# EAGLE design main (EAGLE 6.5.0)
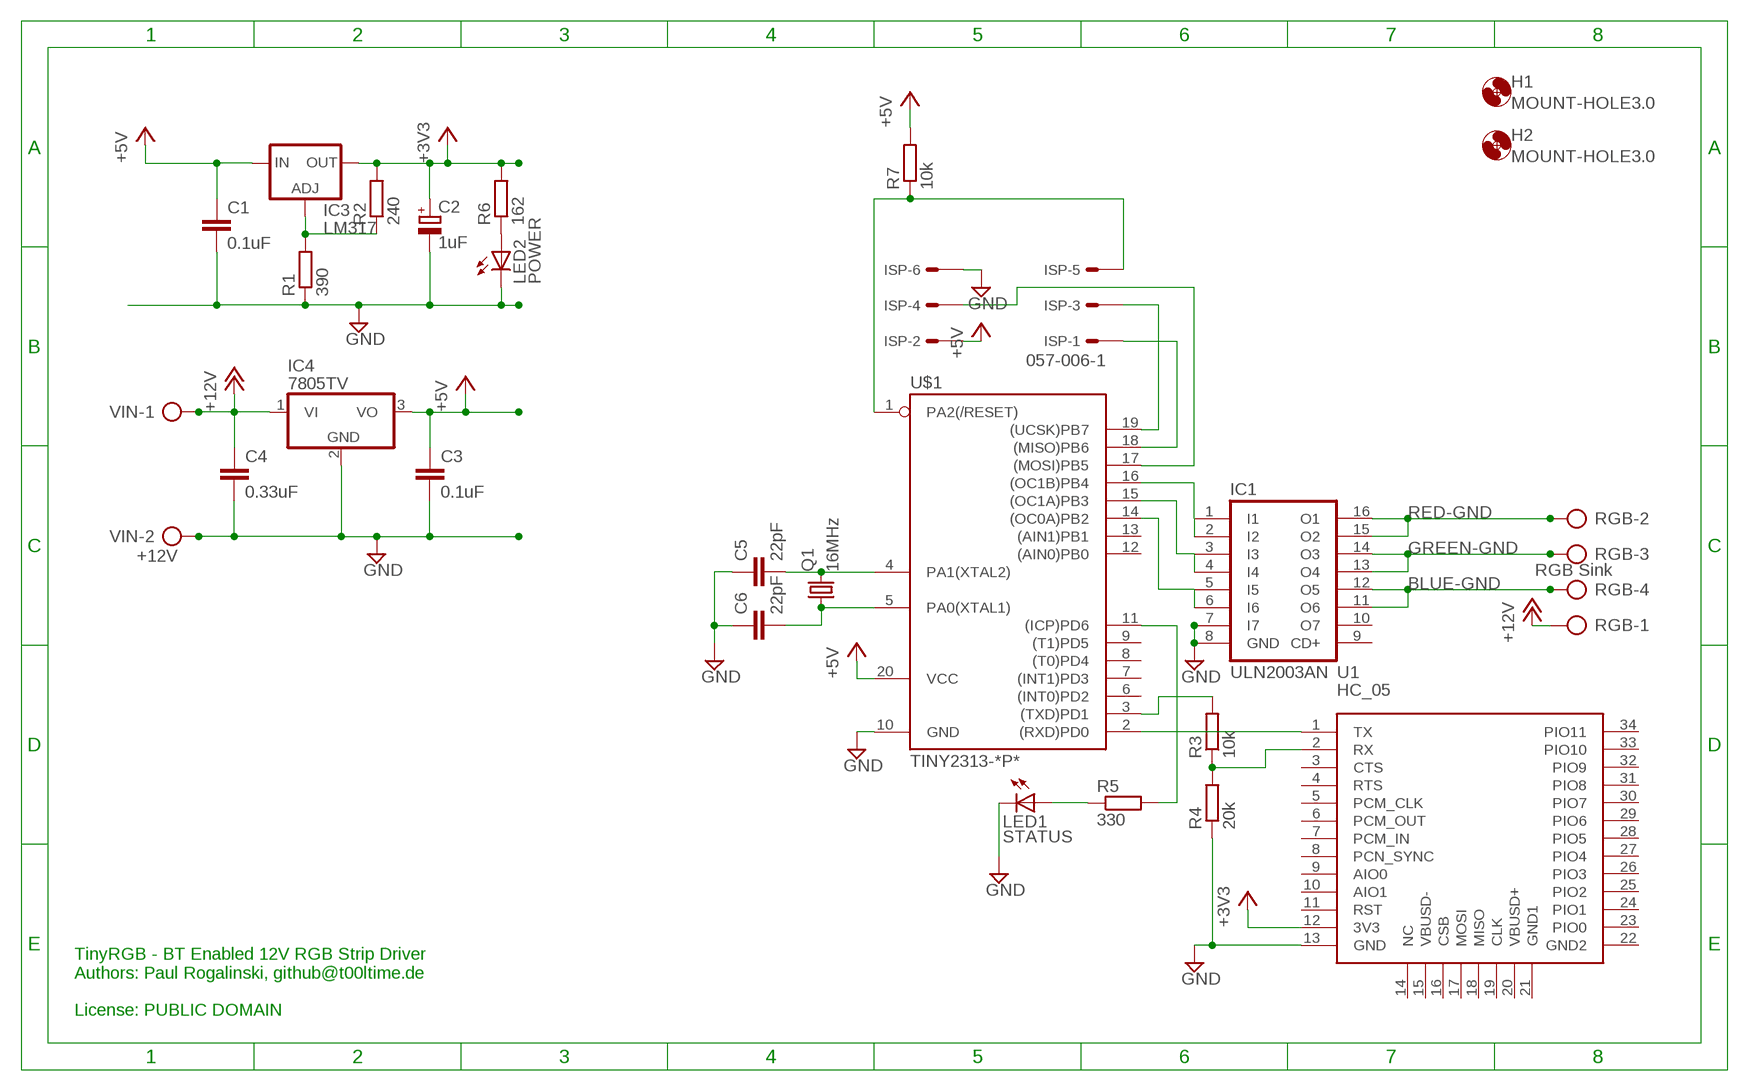
[diagram p0: schematic, sheet 1]

## Parts
C1  0.1uF  C-EU025-025X050  [C025-025X050]
C2  1uF  CPOL-EUE2-5  [E2-5]
C3  0.1uF  C-EU025-025X050  [C025-025X050]
C4  0.33uF  C-EU025_050-025X075  [C025_050-025X075]
C5  22pF  C-EU025-024X044  [C025-024X044]
C6  22pF  C-EU025-024X044  [C025-024X044]
H1  MOUNT-HOLE3.0  [3,0]
H2  MOUNT-HOLE3.0  [3,0]
IC1  ULN2003AN  [DIL16]
IC3  LM317  LM317L  [317L]
IC4  7805TV  [TO220V]
ISP  057-006-1  [057-006-1]
LED1  STATUS  LED3MM  [LED3MM]
LED2  POWER  LED3MM  [LED3MM]
Q1  16MHz  CRYSTALHC49U-V  [HC49U-V]
R1  390  R-EU_0207/5V  [0207/5V]
R2  240  R-EU_0207/5V  [0207/5V]
R3  10k  R-EU_0207/5V  [0207/5V]
R4  20k  R-EU_0207/5V  [0207/5V]
R5  330  R-EU_0207/5V  [0207/5V]
R6  162  R-EU_0207/5V  [0207/5V]
R7  10k  R-EU_0207/5V  [0207/5V]
RGB  RGB Sink  AK500/4  [AK500/4]
U1  HC_05  [BLUETOOTH_SMD]
U$1  TINY2313-*P*  [DIL20]
VIN  +12V  AK500/2  [AK500/2]

## Nets
+3V3: C2.+ IC3.2(OUT) R2.2 R6.2 U1.12(3V3)
+5V: C1.1 C3.1 IC3.3(IN) IC4.3(VO) ISP.2 R7.2 U$1.20(VCC)
+12V: C4.1 IC4.1(VI) RGB.1 VIN.1
BLUE-GND: IC1.11(O6) IC1.12(O5) RGB.4
GND: C1.2 C2.- C3.2 C4.2 C5.1 C6.1 IC1.7(I7) IC1.8(GND) IC4.2(GND) ISP.6 LED1.K(C) LED2.K(C) R1.1 R4.1 U1.13(GND) U$1.10(GND) VIN.2
GREEN-GND: IC1.13(O4) IC1.14(O3) RGB.3
N$1: R3.2 U$1.3((TXD)PD1)
N$2: U1.1(TX) U$1.2((RXD)PD0)
N$3: IC3.1(ADJ) R1.2 R2.1
N$4: IC1.1(I1) IC1.2(I2) U$1.16((OC1B)PB4)
N$5: IC1.3(I3) IC1.4(I4) U$1.15((OC1A)PB3)
N$6: IC1.5(I5) IC1.6(I6) U$1.14((OC0A)PB2)
N$7: C5.2 Q1.2 U$1.4(PA1(XTAL2))
N$8: C6.2 Q1.1 U$1.5(PA0(XTAL1))
N$9: ISP.1 U$1.18((MISO)PB6)
N$10: R3.1 R4.2 U1.2(RX)
N$11: ISP.3 U$1.19((UCSK)PB7)
N$12: ISP.4 U$1.17((MOSI)PB5)
N$13: ISP.5 R7.1 U$1.1(PA2(/RESET))
N$14: LED1.A R5.1
N$16: LED2.A R6.1
N$17: R5.2 U$1.11((ICP)PD6)
RED-GND: IC1.15(O2) IC1.16(O1) RGB.2
Unconnected: IC1.9(CD+) IC1.10(O7) U1.3(CTS) U1.4(RTS) U1.5(PCM_CLK) U1.6(PCM_OUT) U1.7(PCM_IN) U1.8(PCN_SYNC) U1.9(AIO0) U1.10(AIO1) U1.11(RST) U1.14(NC) U1.15(VBUSD-) U1.16(CSB) U1.17(MOSI) U1.18(MISO) U1.19(CLK) U1.20(VBUSD+) U1.21(GND1) U1.22(GND2) U1.23(PIO0) U1.24(PIO1) U1.25(PIO2) U1.26(PIO3) U1.27(PIO4) U1.28(PIO5) U1.29(PIO6) U1.30(PIO7) U1.31(PIO8) U1.32(PIO9) U1.33(PIO10) U1.34(PIO11) U$1.6((INT0)PD2) U$1.7((INT1)PD3) U$1.8((T0)PD4) U$1.9((T1)PD5) U$1.12((AIN0)PB0) U$1.13((AIN1)PB1)

## Notes on the sheet
- TinyRGB - BT Enabled 12V RGB Strip Driver
  Authors: Paul Rogalinski, github@t00ltime.de
  
  License: PUBLIC DOMAIN

## Library data of the parts
C1 C3-C6 = rcl:C-EU: CAPACITOR, European symbol
C2 = rcl:CPOL-EU: POLARIZED CAPACITOR, European symbol
H1 H2 = holes:MOUNT-HOLE: MOUNTING HOLE with drill center marker
IC1 = uln-udn:ULN2003A: DRIVER ARRAY
IC3 = v-reg:LM317L: VOLTAGE REGULATOR
IC4 = linear:78*: Positive VOLTAGE REGULATOR Source: http://cache.national.com/ds/LM/LM78L05.pdf http://www.fairchildsemi.com/ds/LM/LM7805.pdf
ISP = con-panduit:057-006-: CONNECTOR 6-pin series 057 contact pc board low profile headers; OC_FARNELL: unknown; OC_NEWARK: unknown
LED1 LED2 = adafruit:LED: LED OSRAM: - CHIPLED LG R971, LG N971, LY N971, LG Q971, LY Q971, LO R971, LY R971 LH N974, LH R974 LS Q976, LO Q976, LY Q976 LO Q996 - Hyper CHIPLED LW Q18S LB Q993, LB Q99A, LB R99A - SideLED LS A670, LO A670, LY A670, LG A670, LP A670 LB A673, LV A673, LT A673, LW A673 LH A674 LY A675 LS A676, LA A676, LO A676, LY A676, LW A676 LS A679, LY A679, LG A679 - Hyper Micro SIDELED® LS Y876, LA Y876, LO Y876, LY Y876 LT Y87S - SmartLED LW L88C, LW L88S LB L89C, LB L89S, LG L890 LS L89K, LO L89K, LY L89K LS L896, LA L896, LO L896, LY L896 - TOPLED LS T670, LO T670, LY T670, LG T670, LP T670 LSG T670, LSP T670, LSY T670, LOP T670, LYG T670 LG T671, LOG T671, LSG T671 LB T673, LV T673, LT T673, LW T673 LH T674 LS T676, LA T676, LO T676, LY T676, LB T676, LH T676, LSB T676, LW T676 LB T67C, LV T67C, LT T67C, LS T67K, LO T67K, LY T67K, LW E67C LS E67B, LA E67B, LO E67B, LY E67B, LB E67C, LV E67C, LT E67C LW T67C LS T679, LY T679, LG T679 LS T770, LO T770, LY T770, LG T770, LP T770 LB T773, LV T773, LT T773, LW T773 LH T774 LS E675, LA E675, LY E675, LS T675 LS T776, LA T776, LO T776, LY T776, LB T776 LHGB T686 LT T68C, LB T68C - Hyper Mini TOPLED® LB M676 - Mini TOPLED Santana® LG M470 LS M47K, LO M47K, LY M47K Source: http://www.osram.convergy.de/
Q1 = crystal:CRYSTAL: CRYSTAL; OC_FARNELL: 1666969; OC_NEWARK: unknown
R1-R7 = rcl:R-EU_: RESISTOR, European symbol
RGB = con-ptr500:AK500/4: CONNECTOR; OC_FARNELL: unknown; OC_NEWARK: unknown
U1 = Bluetooth HC-05:HC_05: HC-05 Bluetooth Module
U$1 = avr-7:TINY2313*: Atmel Tiny2313 2K Flash, 128 bytes EEPROM, 128 bytes RAM
VIN = con-ptr500:AK500/2: CONNECTOR; OC_FARNELL: unknown; OC_NEWARK: unknown

## Board
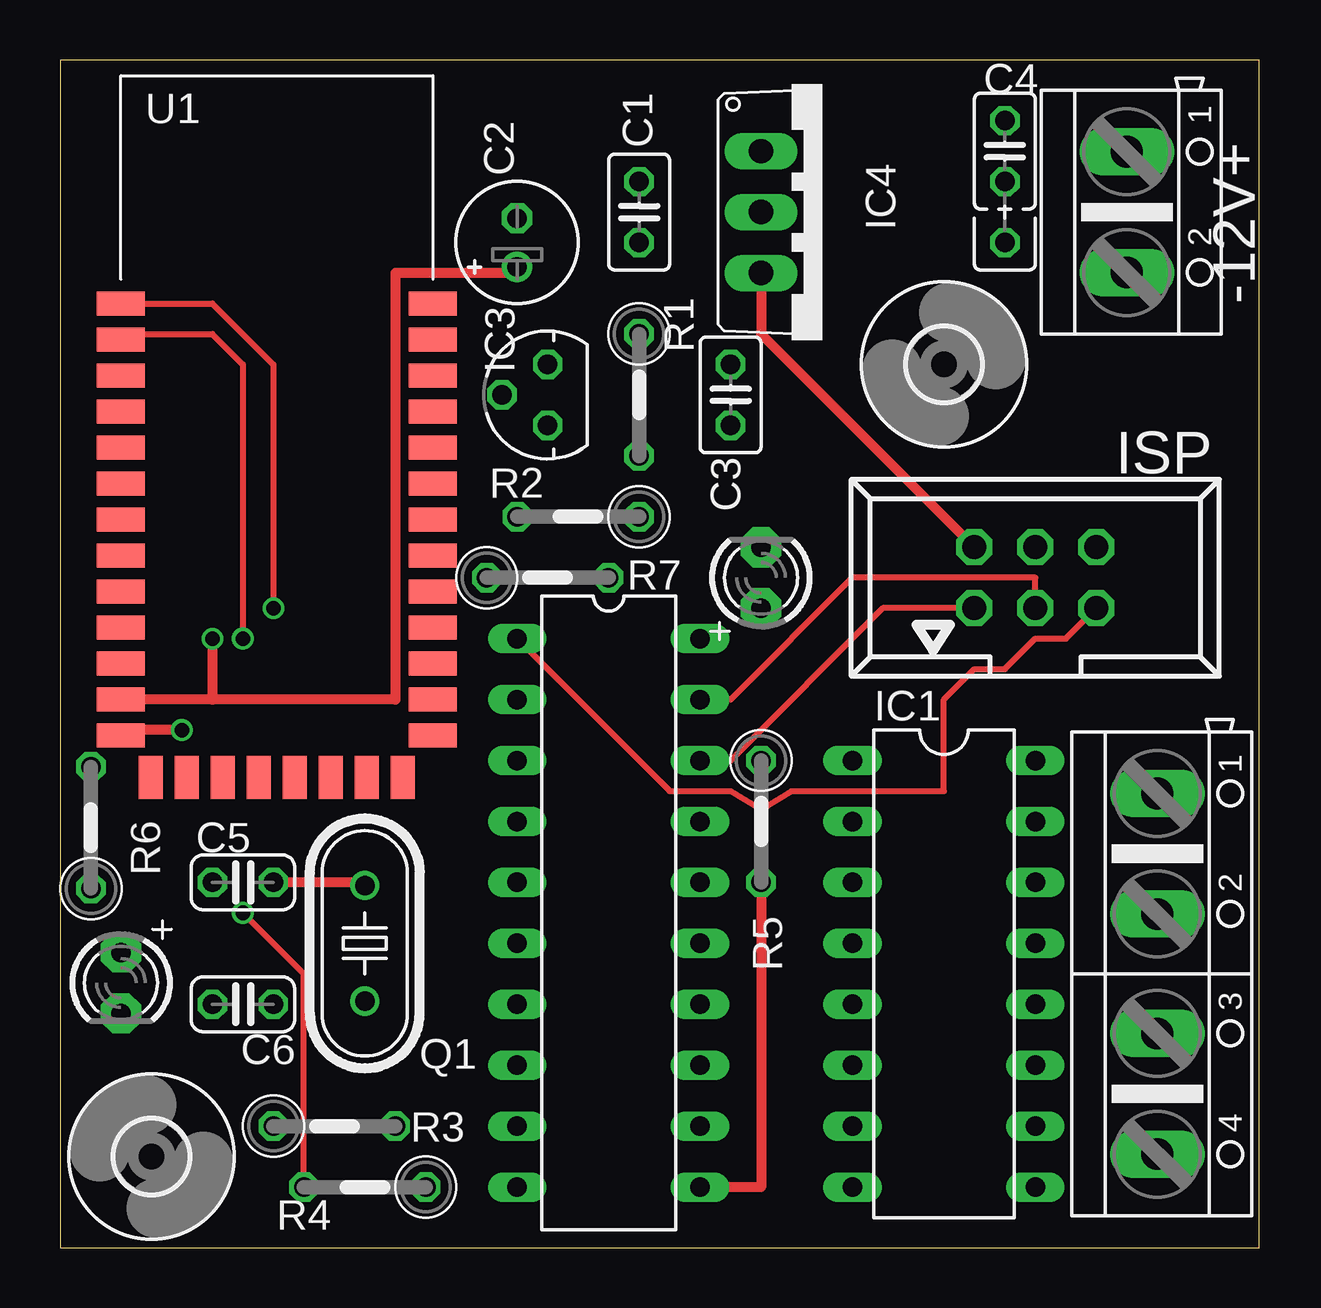
[diagram p1: board, top side]
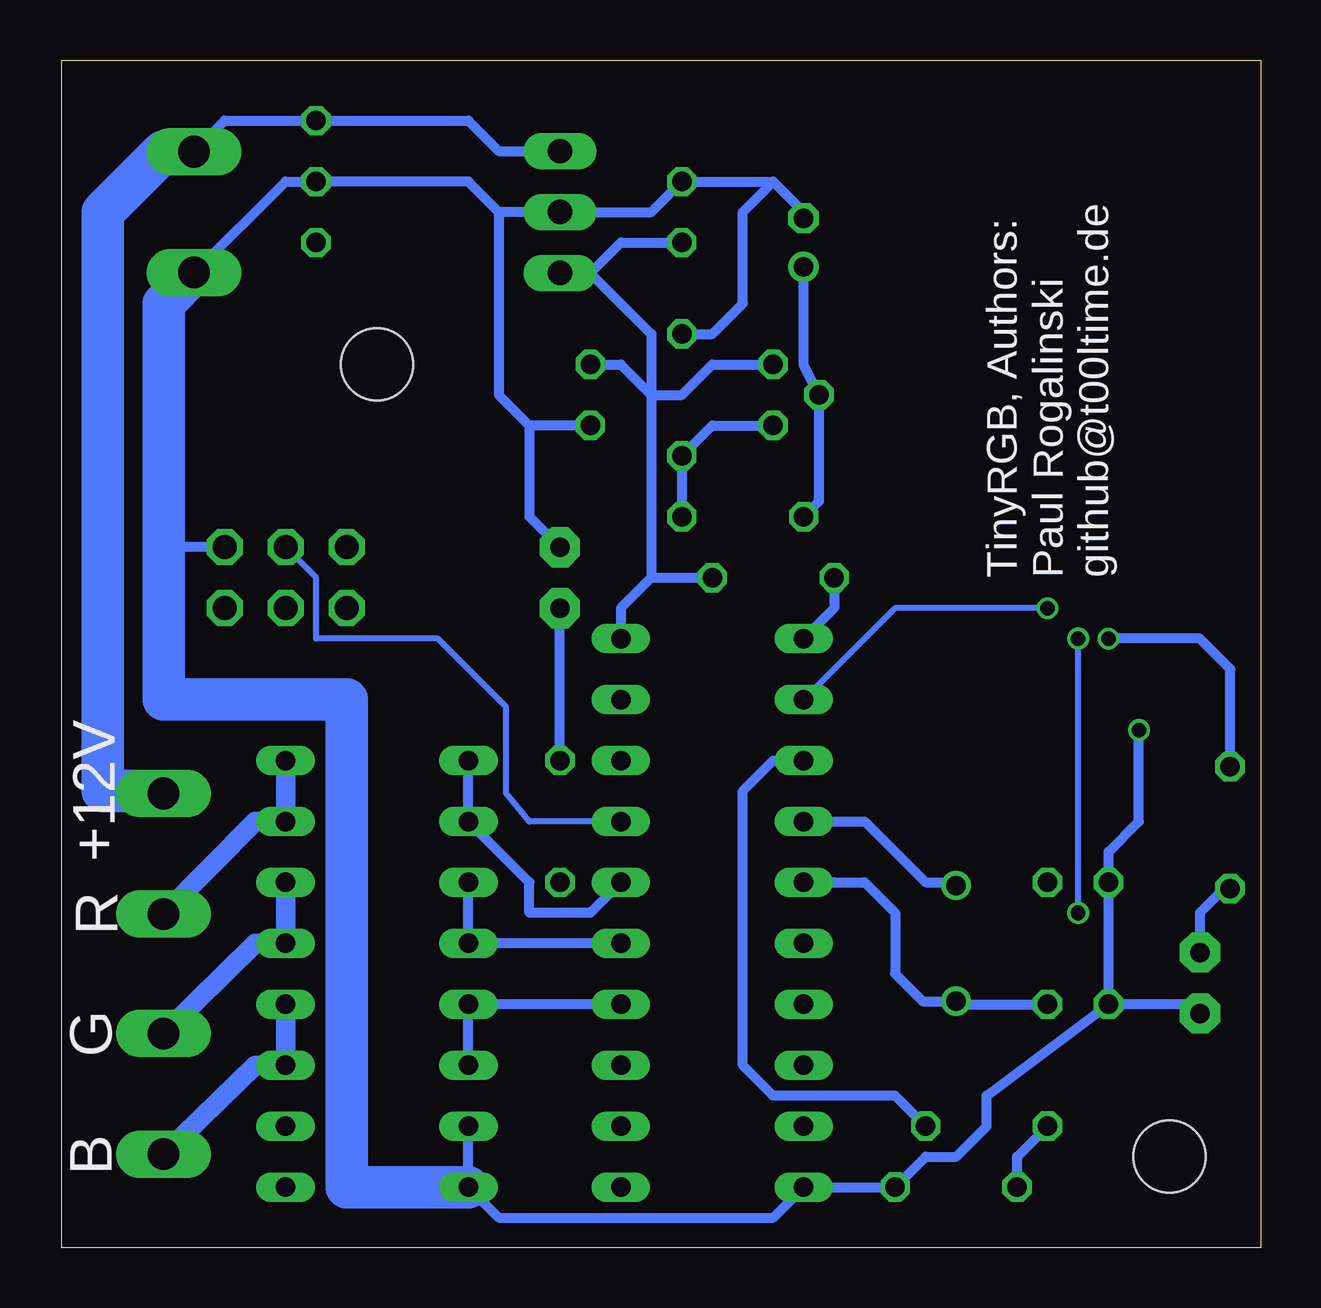
[diagram p2: board, bottom side, seen from below]

Size 49.97 x 49.52 mm. Coordinates in mm from the lower left corner, seen from the top.
Outline: 0,0 49.97,0 49.97,49.52 0,49.52 0,0
Copper layers (1*2*15*16): Top 0.035mm / dielectric 0.2mm / layer 2 0.0175mm / dielectric 1.1mm / layer 15 0.0175mm / dielectric 0.2mm / Bottom 0.035mm
Design rules "SeeedStudio_DRU_no_angle_20130527": minimum track width 6mil, minimum drill 12mil, track to track 6mil, track to pad 6mil, pad to pad 6mil, via to via 6mil, smd to smd 0mil, copper to edge 10mil, drill to drill 10mil, minimum pad ring 6mil, minimum via ring 6mil, stop-mask expansion 2mil, vias tented up to drill 25mil, thermal gap 10mil

### Footprints (pad centres in the part's own frame; a part is rotated, then mirrored left to right if it is on the bottom)
C025-025X050 = drill 0.813 octagon: 1 -1.27,0; 2 1.27,0
E2-5 = drill 0.813 pad 1.27: + -1.016,0 | drill 0.813 pad 1.27 octagon: - 1.016,0
C025_050-025X075 = drill 0.813 octagon: 1 -1.27,0; 2 1.27,0; 3 3.81,0
C025-024X044 = drill 0.813 octagon: 1 -1.27,0; 2 1.27,0
3,0 = hole 3: 0,0
DIL16 = drill 0.813 long: 1 -8.89,-3.81; 2 -6.35,-3.81; 3 -3.81,-3.81; 4 -1.27,-3.81; 5 1.27,-3.81; 6 3.81,-3.81; 7 6.35,-3.81; 8 8.89,-3.81; 9 8.89,3.81; 10 6.35,3.81; 11 3.81,3.81; 12 1.27,3.81; 13 -1.27,3.81; 14 -3.81,3.81; 15 -6.35,3.81; 16 -8.89,3.81
317L = drill 0.813 octagon: 1 -1.27,0; 2 0,1.905; 3 1.27,0
TO220V = drill 1.016 long: 1 -2.54,-2.54; 2 0,-2.54; 3 2.54,-2.54
057-006-1 = drill 1 octagon: 1 -2.54,-1.27; 2 -2.54,1.27; 3 0,-1.27; 4 0,1.27; 5 2.54,-1.27; 6 2.54,1.27
LED3MM = drill 0.813 pad 1.676 octagon: A -1.27,0; K 1.27,0
HC49U-V = drill 0.813: 1 -2.413,0; 2 2.413,0
0207/5V = drill 0.813 octagon: 1 -2.54,0; 2 2.54,0
AK500/4 = drill 1.321 long: 1 -7.518,0; 2 -2.489,0; 3 2.489,0; 4 7.518,0
BLUETOOTH_SMD = smd 2 x 1: 1 -6.35,3.81; 2 -6.35,2.31; 3 -6.35,0.81; 4 -6.35,-0.69; 5 -6.35,-2.19; 6 -6.35,-3.69; 7 -6.35,-5.19; 8 -6.35,-6.69; 9 -6.35,-8.19; 10 -6.35,-9.69; 11 -6.35,-11.19; 12 -6.35,-12.69; 13 -6.35,-14.19; 22 6.65,-14.19; 23 6.65,-12.69; 24 6.65,-11.19; 25 6.65,-9.69; 26 6.65,-8.19; 27 6.65,-6.69; 28 6.65,-5.19; 29 6.65,-3.69; 30 6.65,-2.19; 31 6.65,-0.69; 32 6.65,0.81; 33 6.65,2.31; 34 6.65,3.81 | smd 1 x 1.8: 14 -5.1,-15.94; 15 -3.6,-15.94; 16 -2.1,-15.94; 17 -0.6,-15.94; 18 0.9,-15.94; 19 2.4,-15.94; 20 3.9,-15.94; 21 5.4,-15.94
DIL20 = drill 0.813 long: 1 -11.43,-3.81; 2 -8.89,-3.81; 3 -6.35,-3.81; 4 -3.81,-3.81; 5 -1.27,-3.81; 6 1.27,-3.81; 7 3.81,-3.81; 8 6.35,-3.81; 9 8.89,-3.81; 10 11.43,-3.81; 11 11.43,3.81; 12 8.89,3.81; 13 6.35,3.81; 14 3.81,3.81; 15 1.27,3.81; 16 -1.27,3.81; 17 -3.81,3.81; 18 -6.35,3.81; 19 -8.89,3.81; 20 -11.43,3.81
AK500/2 = drill 1.321 long: 1 -2.515,0; 2 2.515,0

### Placement (x,y rotation side)
C1  24.13,43.18 90 top
C2  19.05,41.91 90 top
C3  27.94,35.56 270 top
C4  39.37,45.72 270 top
C5  7.62,15.24 0 top
C6  7.62,10.16 0 top
H1  36.83,36.83 0 top
H2  3.81,3.81 90 top
IC1  36.83,11.43 270 top
IC3  20.32,35.56 90 top
IC4  31.75,43.18 270 top
ISP  40.64,27.94 0 top
LED1  29.21,27.94 90 top
LED2  2.54,11.05 270 top
Q1  12.7,12.7 90 top
R1  24.13,35.56 270 top
R2  21.59,30.48 180 top
R3  11.43,5.08 0 top
R4  12.7,2.54 180 top
R5  29.21,17.78 270 top
R6  1.29,17.52 90 top
R7  20.32,27.94 0 top
RGB  45.72,11.43 270 top
U1  8.89,35.56 0 top
U$1  22.86,13.97 270 top
VIN  44.45,43.18 270 top

### Tracks (layer width: path | path; a pad name or v marks a point on that pad's centre or on a via)
+3V3  (via drill 0.6)
  Top 0.254: U1.12
  Top 0.406: 6.35,22.86 13.97,22.86 13.97,40.64 19.05,40.64 C2.+ | 6.35,22.86 U1.12 | v6.35,25.4 6.35,22.86
  Bottom 0.406: C2.+ 19.05,36.83 IC3.2 18.41,31.11 R2.2 | R6.2 1.27,20.08 1.27,24.13 2.54,25.4 v6.35,25.4
+5V
  Top 0.406: ISP.2 29.21,38.1 IC4.3
  Bottom 0.406: 27.94,40.64 26.67,41.91 C1.1 | C3.1 26.67,36.83 25.4,35.56 | 25.4,35.56 24.13,35.56 22.86,36.83 IC3.3 | 25.4,35.56 25.4,27.94 | 25.4,27.94 26.67,26.67 U$1.20 | 25.4,27.94 R7.2 | IC4.3 27.94,40.64 | 27.94,40.64 25.4,38.1 25.4,35.56
+12V
  Bottom 0.406: IC4.1 31.75,45.72 33.02,46.99 C4.1 43.18,46.99 44.45,45.72 VIN.1
  Bottom 1.778: RGB.1 45.72,19.05 48.26,19.05 48.26,43.18 45.74,45.7 VIN.1
BLUE-GND
  Bottom 0.813: IC1.12 IC1.11 41.91,7.62 RGB.4
GND  (via drill 0.61)
  Top 0.254: 2.54,21.59 U1.13
  Top 0.406: v5.08,21.59 2.54,21.59
  Bottom 0.406: IC1.7 IC1.8 31.75,1.27 20.32,1.27 U$1.10 R4.1 13.97,3.81 12.7,3.81 11.43,5.08 11.43,6.35 C6.1 | C6.1 C5.1 6.35,16.51 5.08,17.78 v5.08,21.59 | ISP.6 45.72,29.21 | VIN.2 40.64,44.45 C4.2 33.02,44.45 31.75,43.18 | 31.75,43.18 IC4.2 25.4,43.18 C1.2 20.32,44.45 | 31.75,43.18 31.75,35.56 30.48,34.29 | C3.2 30.48,34.29 | LED2.K 2.92,10.16 C6.1 | 20.32,44.45 19.05,43.18 C2.- | R1.1 22.86,38.1 21.59,39.37 21.59,43.18 20.32,44.45 | 30.48,34.29 30.48,30.48 LED1.K
  Bottom 1.778: IC1.8 38.1,2.54 38.1,22.86 45.72,22.86 45.72,29.21 45.72,39.37 VIN.2
GREEN-GND
  Bottom 0.813: IC1.14 IC1.13 41.91,12.7 RGB.3
N$1
  Bottom 0.406: R3.2 15.24,6.35 20.32,6.35 21.59,7.62 21.59,19.05 20.32,20.32 U$1.3
N$2  (via drill 0.6)
  Top 0.254: U1.1 6.35,39.37 8.89,36.83 v8.89,26.67
  Bottom 0.254: v8.89,26.67 15.24,26.67 U$1.2
N$3
  Bottom 0.406: R2.1 R1.2 22.86,34.29 IC3.1
N$4
  Bottom 0.406: IC1.1 IC1.2 30.48,15.24 30.48,13.97 27.94,13.97 U$1.16
N$5
  Bottom 0.406: IC1.4 IC1.3 | 31.75,12.7 IC1.4 | U$1.15 IC1.4
N$6
  Bottom 0.406: IC1.6 IC1.5 | 31.75,10.16 IC1.5 | U$1.14 IC1.5
N$7
  Top 0.406: Q1.2 12.57,15.24 11.43,15.24 C5.2
  Bottom 0.406: U$1.4 17.78,17.78 16.51,17.78 13.97,15.24 12.83,15.24 Q1.2
N$8
  Bottom 0.406: C6.2 12.7,10.16 Q1.1 14.1,10.29 15.24,11.43 15.24,13.97 16.51,15.24 17.78,15.24 U$1.5
N$9
  Top 0.254: U$1.18 27.94,20.32 34.29,26.67 ISP.1
N$10  (via drill 0.61)
  Top 0.254: v7.62,13.97 10.16,11.43 R4.2 | U1.2 2.77,38.1 6.35,38.1 7.62,36.83 v7.62,25.4
  Bottom 0.254: v7.62,13.97 v7.62,25.4
  Bottom 0.406: R4.2 10.16,3.81 R3.1
N$11
  Top 0.254: U$1.19 27.94,22.86 33.02,27.94 40.64,27.94 ISP.3
N$12
  Bottom 0.254: U$1.17 30.48,17.78 31.45,18.95 31.45,22.56 34.29,25.4 39.37,25.4 39.37,27.94 ISP.4
N$13
  Top 0.254: U$1.1 25.4,19.05 27.94,19.05 29.21,18.28 30.48,19.05 36.83,19.05 36.83,22.86 38.1,24.13 39.37,24.13 40.64,25.4 41.91,25.4 ISP.5
  Bottom 0.406: R7.1 17.78,26.67 U$1.1
N$14
  Bottom 0.406: R5.1 LED1.A
N$16
  Bottom 0.406: R6.1 1.53,14.98 2.54,13.97 LED2.A
N$17
  Top 0.406: R5.2 29.21,2.54 U$1.11
RED-GND
  Bottom 0.813: IC1.16 IC1.15 41.91,17.78 RGB.2

### Text on the board
tNames: -12V+
bNames: TinyRGB, Authors: / Paul Rogalinski / github@t00ltime.de | +12V | R | G | B